# EAGLE design ankleBot_v0.2 (EAGLE 7.2.0)
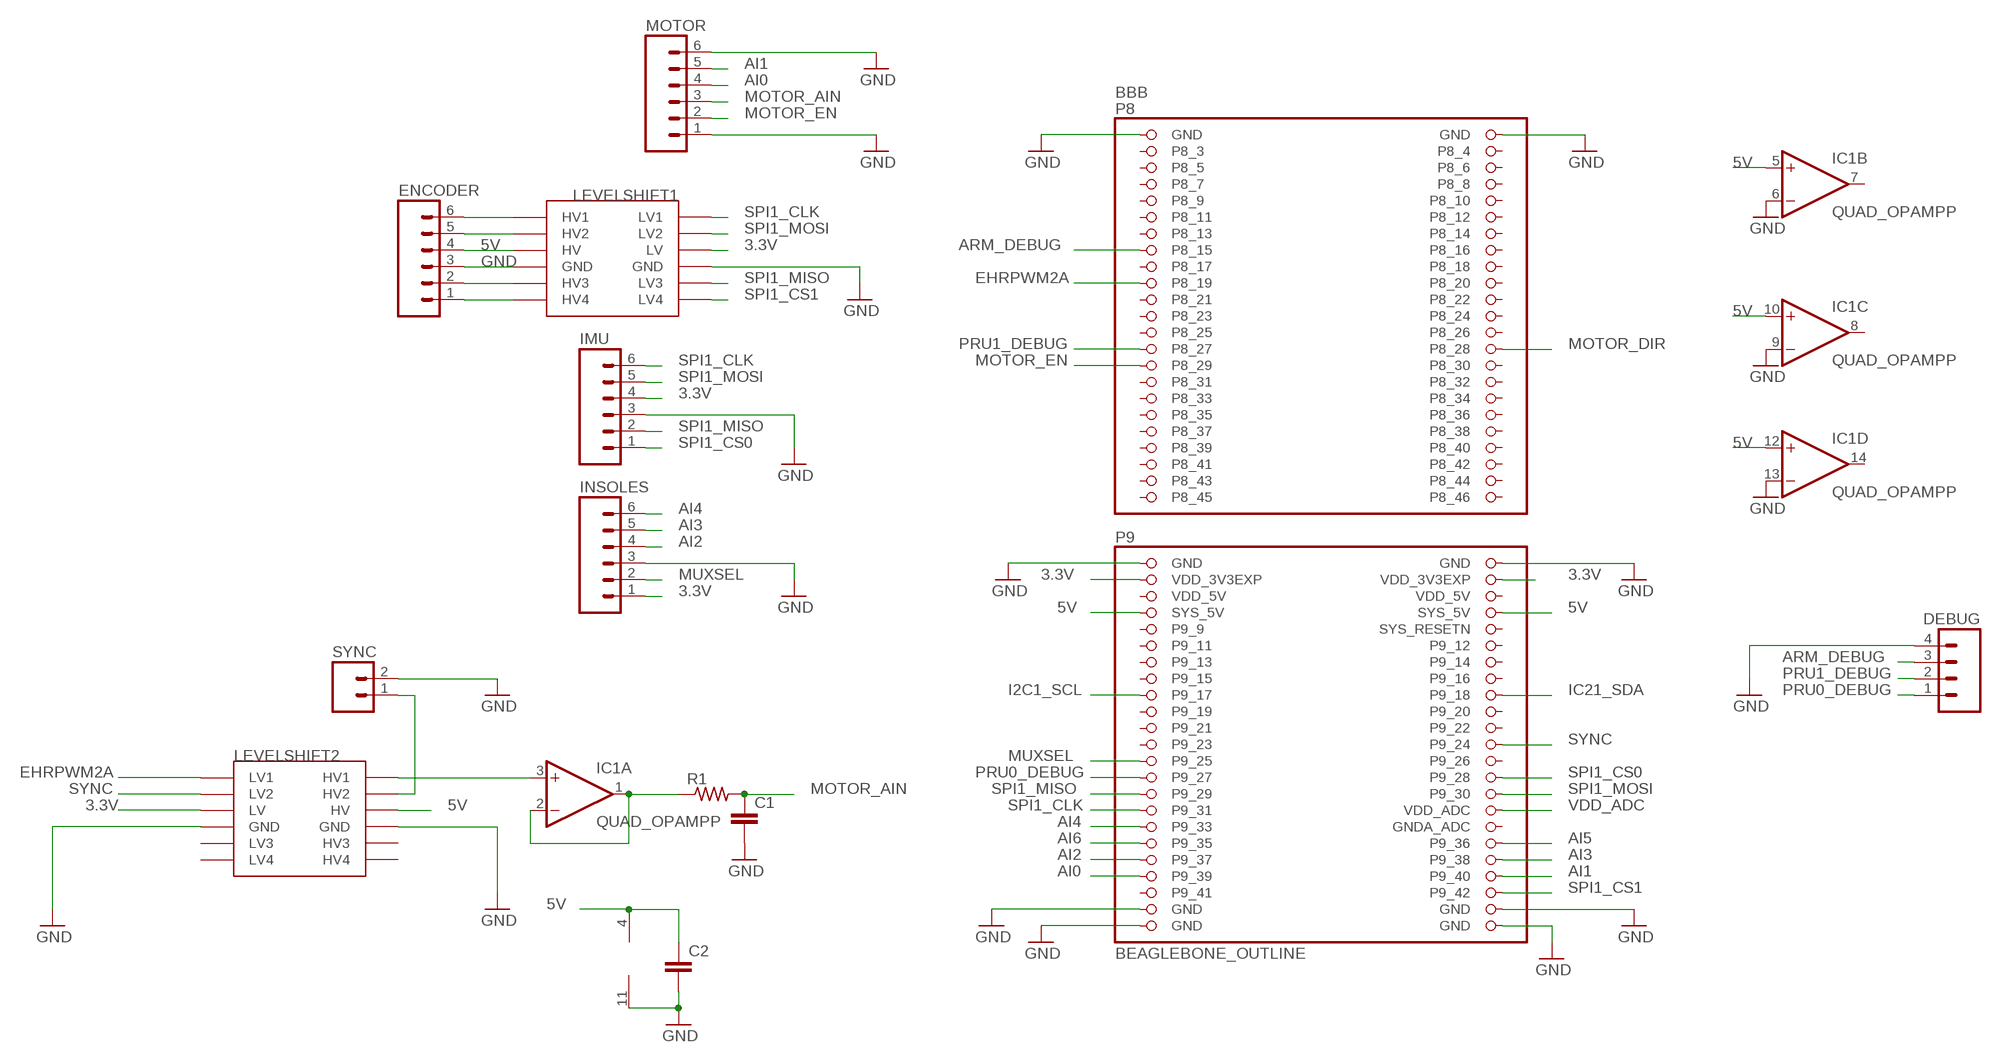
[diagram p0: schematic, sheet 1]

## Parts
BBB  BEAGLEBONE_OUTLINE  [BEAGLEBONE_SHIELD]
C1  C-EU025-025X050  [C025-025X050]
C2  C-EU025-025X050  [C025-025X050]
DEBUG  M04PTH  [1X04]
ENCODER  M06POLAR  [MOLEX-1X6]
IC1  QUAD_OPAMPP  [DIL14]
IMU  M06POLAR  [MOLEX-1X6]
INSOLES  M06POLAR  [MOLEX-1X6]
LEVELSHIFT1  SF_LEVEL_CONVERTER  [SF_LEVEL_CONVERT]
LEVELSHIFT2  SF_LEVEL_CONVERTER  [SF_LEVEL_CONVERT]
MOTOR  M06POLAR  [MOLEX-1X6]
R1  R-US_0204/7  [0204/7]
SYNC  M02POLAR  [MOLEX-1X2]

## Nets
3.3V: BBB.49(VDD_3V3EXP) BBB.50(VDD_3V3EXP) IMU.4 INSOLES.1 LEVELSHIFT1.P$3(LV) LEVELSHIFT2.P$3(LV)
5V: BBB.53(SYS_5V) BBB.54(SYS_5V) C2.1 ENCODER.4 IC1.4(P:V+) IC1.5(B:+IN) IC1.10(C:+IN) IC1.12(D:+IN) LEVELSHIFT1.P$10(HV) LEVELSHIFT2.P$10(HV)
AI0: BBB.85(P9_39) MOTOR.4
AI1: BBB.86(P9_40) MOTOR.5
AI2: BBB.83(P9_37) INSOLES.4
AI3: BBB.84(P9_38) INSOLES.5
AI4: BBB.79(P9_33) INSOLES.6
AI5: BBB.82(P9_36)
AI6: BBB.81(P9_35)
ARM_DEBUG: BBB.15(P8_15) DEBUG.3
EHRPWM2A: BBB.19(P8_19) LEVELSHIFT2.P$1(LV1)
GND: BBB.1(GND) BBB.2(GND) BBB.47(GND) BBB.48(GND) BBB.89(GND) BBB.90(GND) BBB.91(GND) BBB.92(GND) C1.2 C2.2 DEBUG.4 ENCODER.3 IC1.6(B:-IN) IC1.9(C:-IN) IC1.11(P:V-) IC1.13(D:-IN) IMU.3 INSOLES.3 LEVELSHIFT1.P$4(GND) LEVELSHIFT1.P$9(GND) LEVELSHIFT2.P$4(GND) LEVELSHIFT2.P$9(GND) MOTOR.1 MOTOR.6 SYNC.2
I2C1_SCL: BBB.63(P9_17)
IC21_SDA: BBB.64(P9_18)
MOTOR_AIN: C1.1 MOTOR.3 R1.2
MOTOR_DIR: BBB.28(P8_28)
MOTOR_EN: BBB.29(P8_29) MOTOR.2
MUXSEL: BBB.71(P9_25) INSOLES.2
N$1: ENCODER.1 LEVELSHIFT1.P$7(HV4)
N$2: IC1.1(A:OUT) IC1.2(A:-IN) R1.1
N$3: ENCODER.2 LEVELSHIFT1.P$8(HV3)
N$4: LEVELSHIFT2.P$11(HV2) SYNC.1
N$6: ENCODER.5 LEVELSHIFT1.P$11(HV2)
N$7: ENCODER.6 LEVELSHIFT1.P$12(HV1)
N$14: IC1.3(A:+IN) LEVELSHIFT2.P$12(HV1)
PRU0_DEBUG: BBB.73(P9_27) DEBUG.1
PRU1_DEBUG: BBB.27(P8_27) DEBUG.2
SPI1_CLK: BBB.77(P9_31) IMU.6 LEVELSHIFT1.P$1(LV1)
SPI1_CS0: BBB.74(P9_28) IMU.1
SPI1_CS1: BBB.88(P9_42) LEVELSHIFT1.P$6(LV4)
SPI1_MISO: BBB.75(P9_29) IMU.2 LEVELSHIFT1.P$5(LV3)
SPI1_MOSI: BBB.76(P9_30) IMU.5 LEVELSHIFT1.P$2(LV2)
SYNC: BBB.70(P9_24) LEVELSHIFT2.P$2(LV2)
VDD_ADC: BBB.78(VDD_ADC)
Unconnected: BBB.3(P8_3) BBB.4(P8_4) BBB.5(P8_5) BBB.6(P8_6) BBB.7(P8_7) BBB.8(P8_8) BBB.9(P8_9) BBB.10(P8_10) BBB.11(P8_11) BBB.12(P8_12) BBB.13(P8_13) BBB.14(P8_14) BBB.16(P8_16) BBB.17(P8_17) BBB.18(P8_18) BBB.20(P8_20) BBB.21(P8_21) BBB.22(P8_22) BBB.23(P8_23) BBB.24(P8_24) BBB.25(P8_25) BBB.26(P8_26) BBB.30(P8_30) BBB.31(P8_31) BBB.32(P8_32) BBB.33(P8_33) BBB.34(P8_34) BBB.35(P8_35) BBB.36(P8_36) BBB.37(P8_37) BBB.38(P8_38) BBB.39(P8_39) BBB.40(P8_40) BBB.41(P8_41) BBB.42(P8_42) BBB.43(P8_43) BBB.44(P8_44) BBB.45(P8_45) BBB.46(P8_46) BBB.55(P9_9) BBB.56(SYS_RESETN) BBB.57(P9_11) BBB.58(P9_12) BBB.59(P9_13) BBB.60(P9_14) BBB.61(P9_15) BBB.62(P9_16) BBB.65(P9_19) BBB.66(P9_20) BBB.67(P9_21) BBB.68(P9_22) BBB.69(P9_23) BBB.72(P9_26) BBB.80(GNDA_ADC) BBB.87(P9_41) IC1.7(B:OUT) IC1.8(C:OUT) IC1.14(D:OUT) LEVELSHIFT2.P$5(LV3) LEVELSHIFT2.P$6(LV4) LEVELSHIFT2.P$7(HV4) LEVELSHIFT2.P$8(HV3)

## Power pins joined to a net without a drawn wire
VDD_5V: BBB.51(VDD_5V) BBB.52(VDD_5V)

## Library data of the parts
BBB = jreal-lib:BEAGLEBONE_OUTLINE: Should match A3 pinout - but not completely tested
C1 C2 = rcl:C-EU: CAPACITOR, European symbol
DEBUG = SparkFun:M04: Header 4 Standard 4-pin 0.1" header. Use with straight break away headers (SKU : PRT-00116), right angle break away headers (PRT-00553), swiss pins (PRT-00743), machine pins (PRT-00117), and female headers (PRT-00115). Molex polarized connector foot print use with SKU : PRT-08231 with associated crimp pins and housings. 1MM SMD Version SKU: PRT-10208
ENCODER IMU INSOLES MOTOR = SparkFun:M06: Header 6 Standard 6-pin 0.1" header. Use with straight break away headers (SKU : PRT-00116), right angle break away headers (PRT-00553), swiss pins (PRT-00743), machine pins (PRT-00117), and female headers (PRT-00115). Molex polarized connector foot print use with SKU : PRT-08094 with associated crimp pins and housings. NOTES ON THE VARIANTS LOCK and LOCK_LONGPADS... This footprint was designed to help hold the alignment of a through-hole component (i.e. 6-pin header) while soldering it into place. You may notice that each hole has been shifted either up or down by 0.005 of an inch from it's more standard position (which is a perfectly straight line). This slight alteration caused the pins (the squares in the middle) to touch the edges of the holes. Because they are alternating, it causes a "brace" to hold the component in place. 0.005 has proven to be the perfect amount of "off-center" position when using our standard breakaway headers. Although looks a little odd when you look at the bare footprint, once you have a header in there, the alteration is very hard to notice. Also, if you push a header all the way into place, it is covered up entirely on the bottom side. This idea of altering the position of holes to aid alignment will be further integrated into the Sparkfun Library for other footprints. It can help hold any component with 3 or more connection pins.
IC1 = adafruit:QUAD_OPAMP: OP AMP Standard quad package
LEVELSHIFT1 LEVELSHIFT2 = jreal-lib:SF_LEVEL_CONVERTER
R1 = rcl:R-US_: RESISTOR, American symbol
SYNC = SparkFun:M02: Header 2 Standard 2-pin 0.1" header. Use with straight break away headers (SKU : PRT-00116), right angle break away headers (PRT-00553), swiss pins (PRT-00743), machine pins (PRT-00117), and female headers (PRT-00115). Molex polarized connector foot print use with SKU : PRT-08233 with associated crimp pins and housings.

## Board
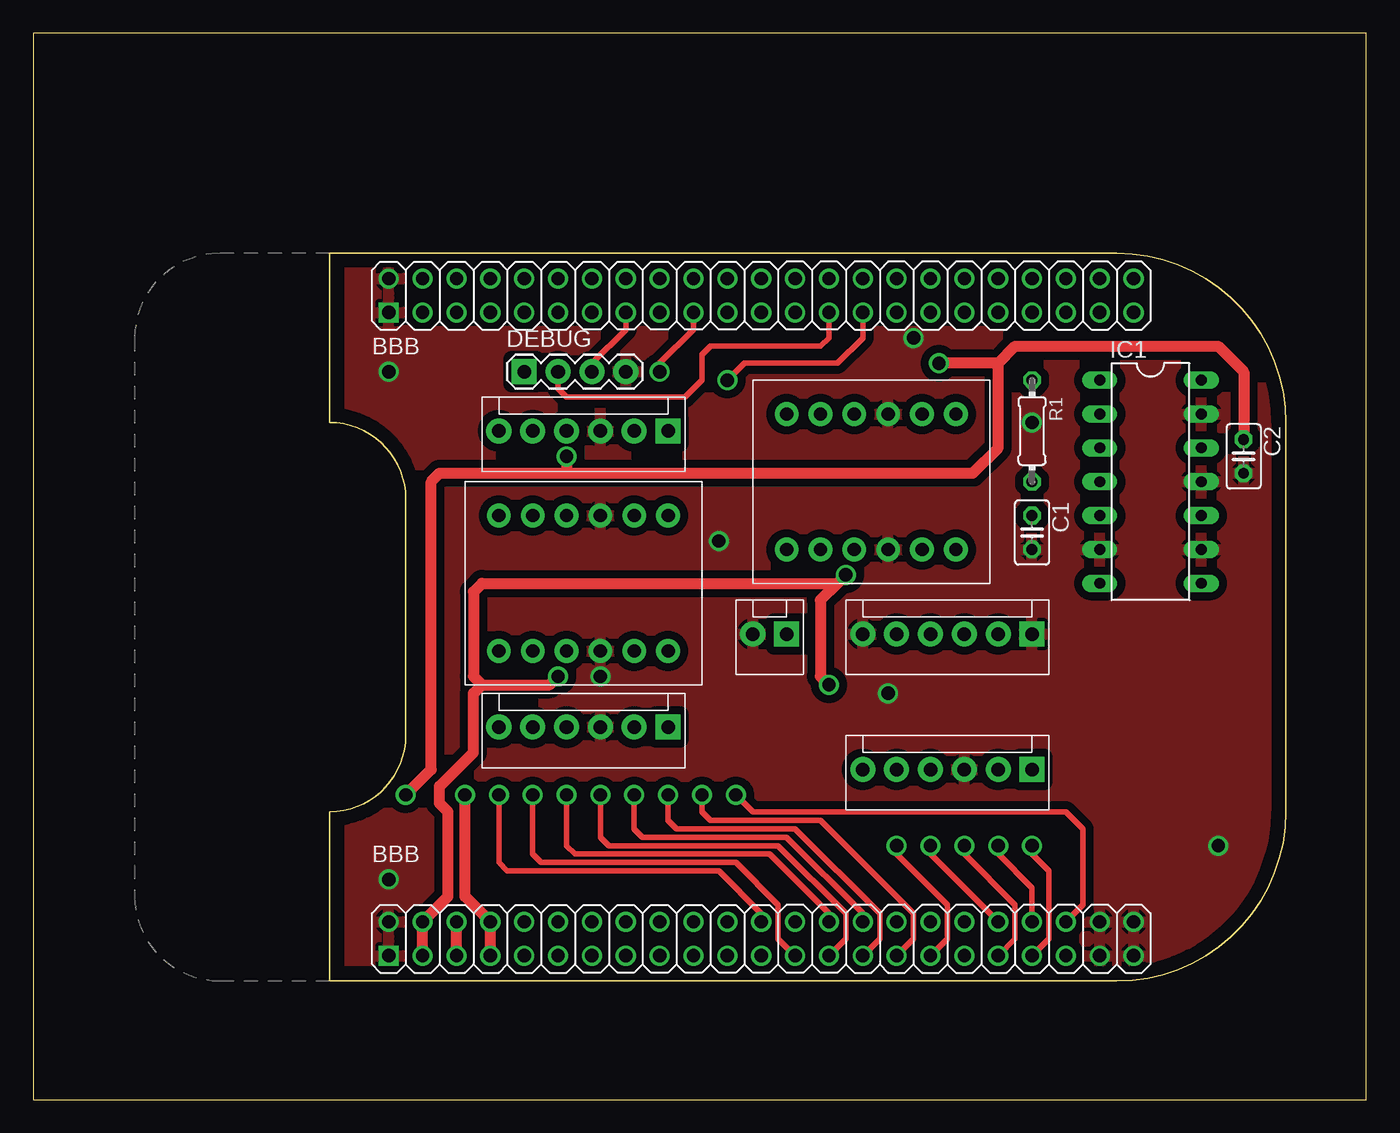
[diagram p1: board, top side]
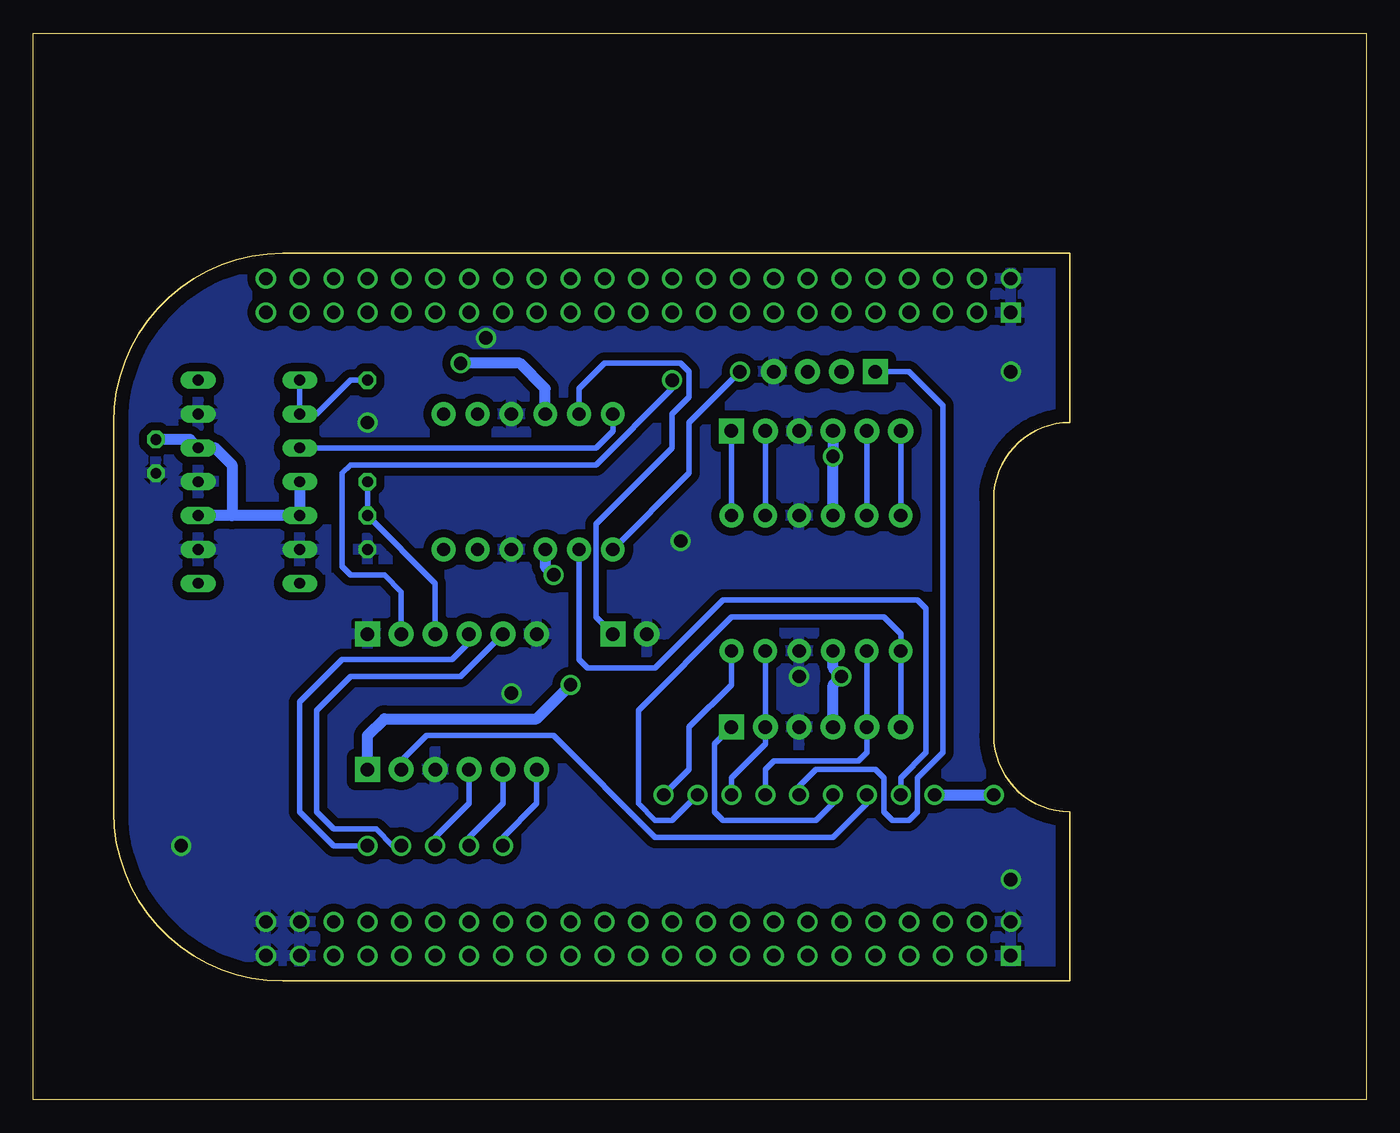
[diagram p2: board, bottom side, seen from below]

Size 100 x 80 mm. Coordinates in mm from the lower left corner, seen from the top.
Outline: 0,0 100,0 100,80 0,80 0,0
Copper layers (1*16): Top 0.035mm / dielectric 1.5mm / Bottom 0.035mm
Design rules "default *": minimum track width 10mil, minimum drill 24mil, track to track 8mil, track to pad 8mil, pad to pad 8mil, via to via 8mil, smd to smd 8mil, copper to edge 40mil, drill to drill 8mil, minimum pad ring 10mil, minimum via ring 8mil, stop-mask expansion 4mil, vias tented up to drill 0mil, thermal gap 10mil

### Footprints (pad centres in the part's own frame; a part is rotated, then mirrored left to right if it is on the bottom)
BEAGLEBONE_SHIELD = drill 1 square: 1 4.445,19.05; 47 52.705,19.05 | drill 1: 2 1.905,19.05; 3 4.445,21.59; 4 1.905,21.59; 5 4.445,24.13; 6 1.905,24.13; 7 4.445,26.67; 8 1.905,26.67; 9 4.445,29.21; 10 1.905,29.21; 11 4.445,31.75; 12 1.905,31.75; 13 4.445,34.29; 14 1.905,34.29; 15 4.445,36.83; 16 1.905,36.83; 17 4.445,39.37; 18 1.905,39.37; 19 4.445,41.91; 20 1.905,41.91; 21 4.445,44.45; 22 1.905,44.45; 23 4.445,46.99; 24 1.905,46.99; 25 4.445,49.53; 26 1.905,49.53; 27 4.445,52.07; 28 1.905,52.07; 29 4.445,54.61; 30 1.905,54.61; 31 4.445,57.15; 32 1.905,57.15; 33 4.445,59.69; 34 1.905,59.69; 35 4.445,62.23; 36 1.905,62.23; 37 4.445,64.77; 38 1.905,64.77; 39 4.445,67.31; 40 1.905,67.31; 41 4.445,69.85; 42 1.905,69.85; 43 4.445,72.39; 44 1.905,72.39; 45 4.445,74.93; 46 1.905,74.93; 48 50.165,19.05; 49 52.705,21.59; 50 50.165,21.59; 51 52.705,24.13; 52 50.165,24.13; 53 52.705,26.67; 54 50.165,26.67; 55 52.705,29.21; 56 50.165,29.21; 57 52.705,31.75; 58 50.165,31.75; 59 52.705,34.29; 60 50.165,34.29; 61 52.705,36.83; 62 50.165,36.83; 63 52.705,39.37; 64 50.165,39.37; 65 52.705,41.91; 66 50.165,41.91; 67 52.705,44.45; 68 50.165,44.45; 69 52.705,46.99; 70 50.165,46.99; 71 52.705,49.53; 72 50.165,49.53; 73 52.705,52.07; 74 50.165,52.07; 75 52.705,54.61; 76 50.165,54.61; 77 52.705,57.15; 78 50.165,57.15; 79 52.705,59.69; 80 50.165,59.69; 81 52.705,62.23; 82 50.165,62.23; 83 52.705,64.77; 84 50.165,64.77; 85 52.705,67.31; 86 50.165,67.31; 87 52.705,69.85; 88 50.165,69.85; 89 52.705,72.39; 90 50.165,72.39; 91 52.705,74.93; 92 50.165,74.93
C025-025X050 = drill 0.813 octagon: 1 -1.27,0; 2 1.27,0
1X04 = drill 1.016 pad 1.88 square: 1 0,0 | drill 1.016 pad 1.88: 2 2.54,0; 3 5.08,0; 4 7.62,0
MOLEX-1X6 = drill 1.016 pad 1.88 square: 1 0,0 | drill 1.016 pad 1.88: 2 2.54,0; 3 5.08,0; 4 7.62,0; 5 10.16,0; 6 12.7,0
DIL14 = drill 0.813 long: 1 -7.62,-3.81; 2 -5.08,-3.81; 3 -2.54,-3.81; 4 0,-3.81; 5 2.54,-3.81; 6 5.08,-3.81; 7 7.62,-3.81; 8 7.62,3.81; 9 5.08,3.81; 10 2.54,3.81; 11 0,3.81; 12 -2.54,3.81; 13 -5.08,3.81; 14 -7.62,3.81
SF_LEVEL_CONVERT = drill 1 pad 1.778: P$1 -5.08,5.08; P$2 -5.08,2.54; P$3 -5.08,0; P$4 -5.08,-2.54; P$5 -5.08,-5.08; P$6 -5.08,-7.62; P$7 5.08,-7.62; P$8 5.08,-5.08; P$9 5.08,-2.54; P$10 5.08,0; P$11 5.08,2.54; P$12 5.08,5.08
0204/7 = drill 0.813 octagon: 1 -3.81,0; 2 3.81,0
MOLEX-1X2 = drill 1.016 pad 1.88 square: 1 0,0 | drill 1.016 pad 1.88: 2 2.54,0

### Placement (x,y rotation side)
BBB  7.62,63.5 270 top
C1  74.93,42.55 270 top
C2  90.81,48.26 270 top
DEBUG  36.83,54.61 0 top
ENCODER  47.62,50.16 180 top
IC1  83.82,46.35 270 top
IMU  47.62,27.94 180 top
INSOLES  74.93,24.77 180 top
LEVELSHIFT1  40.01,38.73 90 top
LEVELSHIFT2  61.59,46.35 90 top
MOTOR  74.93,34.92 180 top
R1  74.93,50.16 270 top
SYNC  56.52,34.92 180 top

### Tracks (layer width: path | path; a pad name or v marks a point on that pad's centre or on a via)
3.3V  (via drill 1 pad 1.42)
  Top 0.813: BBB.49 BBB.50 31.11,15.24 31.11,21.59 30.48,22.23 30.48,23.5 33.02,26.04 33.02,30.48 33.66,31.11 | 60.33,38.73 33.66,38.73 33.02,38.1 33.02,31.75 33.66,31.11 | 33.66,31.11 38.73,31.11 v39.37,31.75 | 60.33,38.73 v60.96,39.37 | 60.33,38.73 59.05,37.47 59.05,31.75 v59.69,31.11
  Bottom 0.813: INSOLES.1 74.93,27.3 73.66,28.57 62.23,28.57 v59.69,31.11 | LEVELSHIFT1.P$3 40.01,32.38 v39.37,31.75 40.01,31.11 IMU.4 | LEVELSHIFT2.P$3 61.59,40.01 v60.96,39.37
5V  (via drill 1 pad 1.42)
  Top 0.813: BBB.53 BBB.54 32.38,15.24 v32.38,22.86 | 72.39,55.24 72.39,48.9 70.48,46.99 40.01,46.99 | 72.39,55.24 73.66,56.52 88.9,56.52 90.81,54.61 C2.1 | 40.01,46.99 30.48,46.99 29.84,46.35 29.84,24.77 v27.94,22.86 | v40.01,48.26 40.01,46.99 | 72.39,55.24 v67.94,55.24
  Bottom 0.813: v32.38,22.86 v27.94,22.86 | LEVELSHIFT2.P$10 61.59,53.34 63.5,55.24 v67.94,55.24 | C2.1 88.27,49.53 IC1.12 86.36,48.9 85.09,47.62 85.09,43.81 | IC1.4 IC1.5 85.09,43.81 | 85.09,43.81 IC1.10 | ENCODER.4 v40.01,48.26 LEVELSHIFT1.P$10
AI0  (via drill 1 pad 1.42)
  Top 0.406: BBB.85 76.2,12.06 76.2,17.14 74.93,18.41 v74.93,19.05
  Bottom 0.406: MOTOR.4 67.31,34.29 68.58,33.02 76.83,33.02 80.01,29.84 80.01,21.59 77.47,19.05 v74.93,19.05
AI1  (via drill 1 pad 1.42)
  Top 0.406: BBB.86 74.93,15.88 72.39,18.41 v72.39,19.05
  Bottom 0.406: v72.39,19.05 73.03,19.05 74.3,20.32 77.47,20.32 78.74,21.59 78.74,29.21 76.2,31.75 67.94,31.75 MOTOR.5
AI2  (via drill 1 pad 1.42)
  Top 0.406: BBB.83 73.66,12.06 73.66,14.61 69.85,18.41 v69.85,19.05
  Bottom 0.406: INSOLES.4 67.31,22.23 69.85,19.68 v69.85,19.05
AI3  (via drill 1 pad 1.42)
  Top 0.406: v67.31,19.05 67.31,18.41 BBB.84
  Bottom 0.406: INSOLES.5 64.77,22.23 67.31,19.68 v67.31,19.05
AI4  (via drill 1 pad 1.42)
  Top 0.406: BBB.79 68.58,12.06 68.58,14.61 64.77,18.41 v64.77,19.05
  Bottom 0.406: INSOLES.6 62.23,22.23 64.77,19.68 v64.77,19.05
ARM_DEBUG
  Top 0.406: BBB.15 44.45,57.78 41.91,55.24 DEBUG.3
EHRPWM2A  (via drill 1 pad 1.42)
  Top 0.406: v46.99,54.61 46.99,55.24 49.53,57.78 BBB.19
  Bottom 0.406: LEVELSHIFT2.P$1 50.8,46.99 50.8,50.8 v46.99,54.61
GND  (via drill 1 pad 1.42)
  other vias: 26.67,16.51 42.55,31.75 74.93,50.8 26.67,54.61 88.9,19.05 66.04,57.15 51.44,41.91 64.14,30.48
  pour Top (isolate 0.61): 22.23,66.04 22.23,8.26 95.25,8.26 95.25,67.31 22.23,67.31
  pour Bottom (isolate 0.61): 22.86,63.5 22.86,7.62 94.61,7.62 94.61,64.77 22.86,64.77
MOTOR_AIN
  Bottom 0.406: R1.2 C1.1 69.85,38.73 MOTOR.3
MOTOR_EN  (via drill 1 pad 1.42)
  Top 0.406: BBB.29 62.23,57.15 60.33,55.24 53.34,55.24 v52.07,53.98
  Bottom 0.406: MOTOR.2 72.39,38.1 73.66,39.37 76.2,39.37 76.83,40.01 76.83,46.99 76.2,47.62 57.78,47.62 52.07,53.34 v52.07,53.98
MUXSEL  (via drill 1 pad 1.42)
  Top 0.406: BBB.71 55.88,12.06 55.88,14.61 52.7,17.78 38.1,17.78 37.47,18.41 v37.47,22.86
  Bottom 0.406: INSOLES.2 72.39,25.4 70.48,27.3 60.96,27.3 53.34,19.68 40.01,19.68 37.47,22.23 v37.47,22.86
N$1
  Bottom 0.406: LEVELSHIFT1.P$7 ENCODER.1
N$2
  Bottom 0.406: IC1.1 IC1.2 78.74,51.44 76.2,53.98 R1.1
N$3
  Bottom 0.406: LEVELSHIFT1.P$8 ENCODER.2
N$4
  Bottom 0.406: SYNC.1 57.78,36.2 57.78,43.18 52.07,48.9 52.07,51.44 50.8,52.7 50.8,54.61 51.44,55.24 57.15,55.24 59.05,53.34 LEVELSHIFT2.P$11
N$6
  Bottom 0.406: LEVELSHIFT1.P$11 ENCODER.5
N$7
  Bottom 0.406: LEVELSHIFT1.P$12 ENCODER.6
N$14
  Bottom 0.406: LEVELSHIFT2.P$12 56.52,50.16 57.78,48.9 IC1.3
PRU0_DEBUG  (via drill 1 pad 1.42)
  Top 0.406: BBB.73 60.96,12.06 60.96,13.97 55.88,19.05 43.18,19.05 42.55,19.68 v42.55,22.86
  Bottom 0.406: v42.55,22.86 42.55,23.5 41.27,24.77 36.83,24.77 36.2,24.13 36.2,21.59 35.56,20.95 34.29,20.95 33.66,21.59 33.66,24.13 31.75,26.04 31.75,52.07 34.29,54.61 DEBUG.1
PRU1_DEBUG
  Top 0.406: BBB.27 59.69,57.15 59.05,56.52 50.8,56.52 50.16,55.88 50.16,53.98 48.9,52.7 40.01,52.7 39.37,53.34 DEBUG.2
SPI1_CLK  (via drill 1 pad 1.42)
  Top 0.406: BBB.77 66.04,12.06 66.04,13.97 59.05,20.95 50.8,20.95 50.16,21.59 v50.16,22.86
  Bottom 0.406: IMU.6 LEVELSHIFT1.P$1 34.92,34.92 36.2,36.2 47.62,36.2 54.61,29.21 54.61,22.23 53.34,20.95 52.07,20.95 v50.16,22.86
SPI1_CS0  (via drill 1 pad 1.42)
  Top 0.406: BBB.74 59.69,13.97 55.24,18.41 40.64,18.41 40.01,19.05 v40.01,22.86
  Bottom 0.406: v40.01,22.86 40.01,22.23 41.27,20.95 48.26,20.95 48.9,21.59 48.9,26.67 IMU.1
SPI1_CS1  (via drill 1 pad 1.42)
  Top 0.406: BBB.88 78.74,14.61 78.74,20.32 77.47,21.59 53.98,21.59 v52.7,22.86
  Bottom 0.406: LEVELSHIFT1.P$6 47.62,31.11 50.8,27.94 50.8,24.77 v52.7,22.86
SPI1_MISO  (via drill 1 pad 1.42)
  Top 0.406: BBB.75 63.5,12.06 63.5,13.97 57.15,20.32 48.26,20.32 47.62,20.95 v47.62,22.86
  Bottom 0.406: LEVELSHIFT1.P$5 IMU.2 45.09,26.67 47.62,24.13 v47.62,22.86
SPI1_MOSI  (via drill 1 pad 1.42)
  Top 0.406: BBB.76 62.23,13.97 56.52,19.68 45.72,19.68 45.09,20.32 v45.09,22.86
  Bottom 0.406: LEVELSHIFT1.P$2 IMU.5 37.47,26.04 38.1,25.4 44.45,25.4 45.09,24.77 v45.09,22.86
SYNC  (via drill 1 pad 1.42)
  Top 0.406: BBB.70 54.61,13.97 51.44,17.14 35.56,17.14 34.92,17.78 v34.92,22.86
  Bottom 0.406: LEVELSHIFT2.P$2 59.05,33.02 58.42,32.38 53.34,32.38 48.26,37.47 33.66,37.47 33.02,36.83 33.02,26.04 34.92,24.13 v34.92,22.86
VDD_5V
  Top 0.813: BBB.51 BBB.52